# Altium schematic sheet watchdog.SchDoc: Watchdog
size A4; Organization: Badgerloop Electrical; Address1: 133 Engineering Research Building; Address2: 1500 Engineering Drive; Address3: Madison, Wi 53706
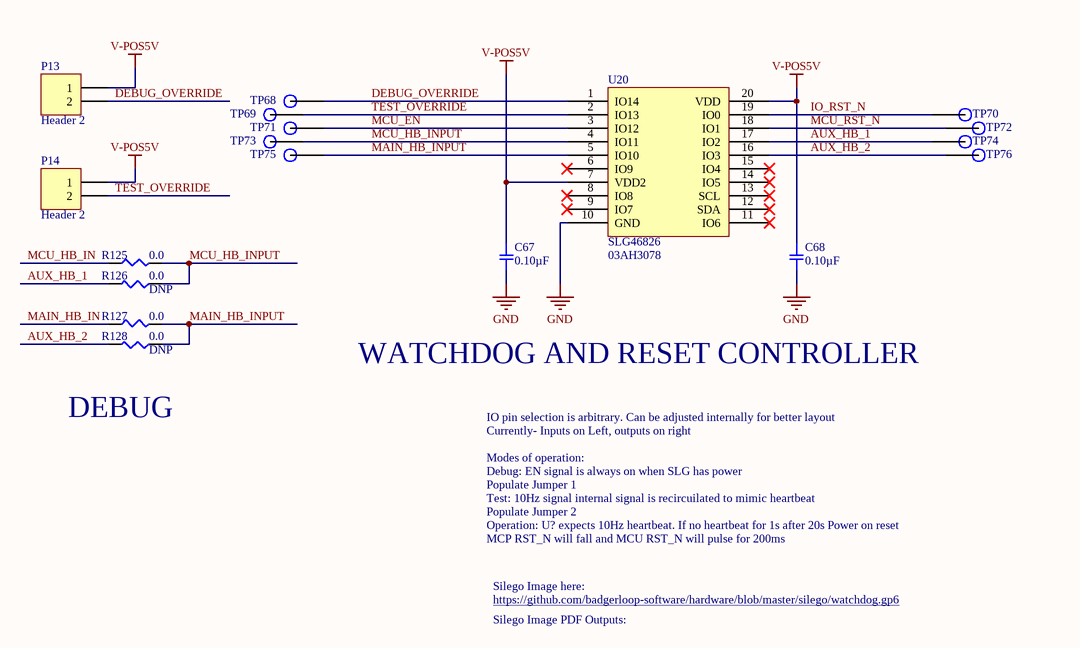
[diagram p0: watchdog.SchDoc]

## Parts
C67  0.10µF  [SMD-0805C]
C68  0.10µF  [SMD-0805C]
P13  Header 2  [Pin Header 1x2 TH Pitch 2.54mm]
P14  Header 2  [Pin Header 1x2 TH Pitch 2.54mm]
R125  0.0  [SMD-0805-RES]
R126  0.0  [SMD-0805-RES]
R127  0.0  [SMD-0805-RES]
R128  0.0  [SMD-0805-RES]
TP68  TP  [Test Point]  (value not drawn)
TP69  TP  [Test Point]  (value not drawn)
TP70  TP  [Test Point]  (value not drawn)
TP71  TP  [Test Point]  (value not drawn)
TP72  TP  [Test Point]  (value not drawn)
TP73  TP  [Test Point]  (value not drawn)
TP74  TP  [Test Point]  (value not drawn)
TP75  TP  [Test Point]  (value not drawn)
TP76  TP  [Test Point]  (value not drawn)
U20  SLG46826  Supplier Part Number 1: 03AH3078  [SOP65P640X175-20N]

## Nets
GND: C67.2 C68.2 U20.10(GND)
V-POS5V: C67.1 C68.1 P13.1 P14.1 U20.7(VDD2) U20.20(VDD)
AUX_HB_1: R126.2 TP74.1 U20.17(IO2)
AUX_HB_2: R128.2 TP76.1 U20.16(IO3)
DEBUG_OVERRIDE: P13.2 TP68.1 U20.1(IO14)
IO_RST_N: TP70.1 U20.19(IO0)
MAIN_HB_IN: R127.1
MAIN_HB_INPUT: R127.2 R128.1 TP75.1 U20.5(IO10)
MCU_EN: TP71.1 U20.3(IO12)
MCU_HB_IN: R125.1
MCU_HB_INPUT: R125.2 R126.1 TP73.1 U20.4(IO11)
MCU_RST_N: TP72.1 U20.18(IO1)
TEST_OVERRIDE: P14.2 TP69.1 U20.2(IO13)

Not connected (* = marked no-connect by the designer): U20 6(IO9)* 8(IO8)* 9(IO7)* 11(IO6)* 12(SDA)* 13(SCL)* 14(IO5)* 15(IO4)*

## Notes on the sheet
- WATCHDOG AND RESET CONTROLLER
- DEBUG
- IO pin selection is arbitrary. Can be adjusted internally for better layout
- Currently- Inputs on Left, outputs on right
- Modes of operation:
- Debug: EN signal is always on when SLG has power
- Populate Jumper 1
- Test: 10Hz signal internal signal is recircuilated to mimic heartbeat
- Populate Jumper 2
- Operation: U? expects 10Hz heartbeat. If no heartbeat for 1s after 20s Power on reset
- MCP RST_N will fall and MCU RST_N will pulse for 200ms
- Silego Image here:
- https://github.com/badgerloop-software/hardware/blob/master/silego/watchdog.gp6
- Silego Image PDF Outputs:
- Title
- Engineer:
- Date:
- Time:
- Revision:
- Sheet
- of
- File:

## Library data of the parts
C67 C68 = GRM219R71E104KA01D: CAP CER 0.1UF 25V X7R 0805; Manufacturer: Murata Electronics North America; Factory Stock: 0; Unit Price (USD): 0.12; Minimum Quantity: 1; Tolerance: ±10%; Datasheets: http://www.murata.com/~/media/webrenewal/support/library/catalog/products/capacitor/mlcc/c02e.pdf; Image: //media.digikey.com/Renders/Murata%20Renders/0805%20(2012%20Metric)%20.85mm.jpg; Digi-Key Part Number: 490-12754-1-ND; Part Number: GRM219R71E104KA01D; Quantity Available: 8594; @ qty: 0; Packaging: Cut Tape (CT); Series: GRM; Part Status: Active; Value: 0.10µF; Voltage: 25V; Temperature Coefficient: X7R; Operating Temperature: -55°C ~ 125°C; Features: -; Ratings: -; Applications: General Purpose; Mounting Type: Surface Mount, MLCC; Package / Case: 0805 (2012 Metric); Size / Dimension: 0.079" L x 0.049" W (2.00mm x 1.25mm); Height - Seated (Max): -; Thickness (Max): 0.037" (0.95mm); Lead Spacing: -; Lead Style: -
P13 P14 = Header 2: Header, 2-Pin; LatestRevisionDate: 17-Jul-2002; LatestRevisionNote: Re-released for DXP Platform.; Publisher: Altium Limited
R125-R128 = ERJ-6GEY0R00V: RES SMD 0.0 OHM JUMPER 1/8W 0805; Manufacturer: Panasonic Electronic Components; Factory Stock: 0; Unit Price (USD): 0.00544; @ qty: 1500; Minimum Quantity: 1; Power (Watts): 0.125W, 1/8W; Part Number: ERJ-6GEY0R00V; Datasheets: http://industrial.panasonic.com/www-cgi/jvcr13pz.cgi?E+PZ+3+AOA0001+ERJ6GEY0R00V+7+WW; Image: //media.digikey.com/Renders/Panasonic%20Renders/ERJ-0805%20Pkg.jpg; Digi-Key Part Number: P0.0ACT-ND; Quantity Available: 1597627; Packaging: Cut Tape (CT); Series: ERJ; Part Status: Active; Value: 0.0; Tolerance: Jumper; Composition: Thick Film; Features: Automotive AEC-Q200; Temperature Coefficient: -; Operating Temperature: -55°C ~ 155°C; Package / Case: 0805 (2012 Metric); Supplier Device Package: 0805; Size / Dimension: 0.079" L x 0.049" W (2.00mm x 1.25mm); Height - Seated (Max): 0.028" (0.70mm); Number of Terminations: 2; Failure Rate: -
  R126 R128: DNP: DNP
TP68-TP76 = TP: SMD TEST POINT
U20 = SLG46826: GreenPAK Programmable Mixed Signal Matrix with In-System Programmability; Manufacturer: Dialog Semiconductor; Manufacturer Part Number: SLG46826V-SKT; Supplier 1: Newark; Stock 1: 4; Pricing 1: 1=45.65000, 5=44.43000, 10=43.15000, 25=42.51000, 50=41.89000, 100=39.38000 (USD); RoHS: No